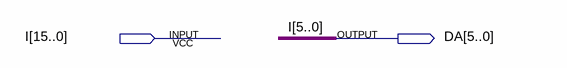
[diagram p0: schematic sheet]
// Quartus schematic DAD.bdf as structural Verilog: 0 symbols, 2 pins
module DAD (
  input  [15:0] I,
  output [5:0] DA
);


  assign DA = I[5:0];
endmodule
